# Altium schematic sheet Extra.SchDoc
size A4; SheetNumber: 5; SheetTotal: 5
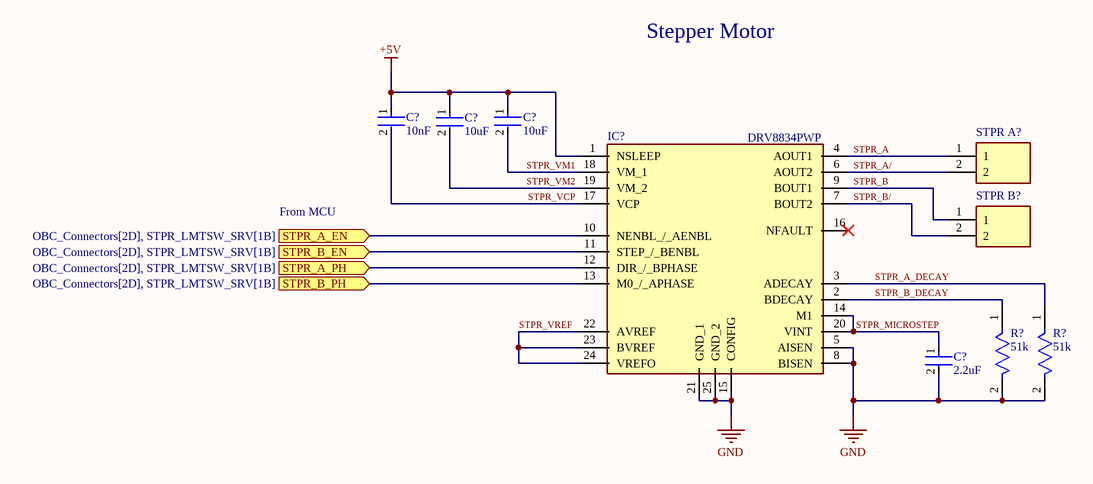
[diagram p0: Extra.SchDoc]

## Parts
(Parts that share a designator on the sheet are numbered #1, #2 ... from top to bottom, then left to right.)
C?#1  10nF  [FP-C1206C-EB-MFG]
C?#2  10uF  [FP-GRM31C-0_2-e0_3_0_8-MFG]
C?#3  10uF  [FP-GRM31C-0_2-e0_3_0_8-MFG]
C?#4  2.2uF  [FP-GRM188-0_1-e0_2_0_5-MFG]
IC?  DRV8834PWP  [SOP65P640X120-25N]
R?#1  51k  [FP-CRCW0603-e3-MFG]
R?#2  51k  [FP-CRCW0603-e3-MFG]
STPR_A?  0022284023  [HDRV2W87P0X254_1X2_508X249X863P]  (value not drawn)
STPR_B?  0022284023  [HDRV2W87P0X254_1X2_508X249X863P]  (value not drawn)

## Ports
STPR_A_EN (in, see OBC_Connectors[2D], STPR_LMTSW_SRV[1B]), STPR_A_PH (in, see OBC_Connectors[2D], STPR_LMTSW_SRV[1B]), STPR_B_EN (in, see OBC_Connectors[2D], STPR_LMTSW_SRV[1B]), STPR_B_PH (in, see OBC_Connectors[2D], STPR_LMTSW_SRV[1B])

## Nets
+5V: C?#1.1 C?#2.1 C?#3.1 IC?.1(NSLEEP)
GND: C?#4.2 IC?.5(AISEN) IC?.8(BISEN) IC?.15(CONFIG) IC?.21(GND_1) IC?.25(GND_2) R?#1.2 R?#2.2
STPR_A: IC?.4(AOUT1) STPR_A?.1
STPR_A/: IC?.6(AOUT2) STPR_A?.2
STPR_A_DECAY: IC?.3(ADECAY) R?#2.1
STPR_A_EN: IC?.10(NENBL_/_AENBL) ; port STPR_A_EN
STPR_A_PH: IC?.12(DIR_/_BPHASE) ; port STPR_A_PH
STPR_B: IC?.9(BOUT1) STPR_B?.1
STPR_B/: IC?.7(BOUT2) STPR_B?.2
STPR_B_DECAY: IC?.2(BDECAY) R?#1.1
STPR_B_EN: IC?.11(STEP_/_BENBL) ; port STPR_B_EN
STPR_B_PH: IC?.13(M0_/_APHASE) ; port STPR_B_PH
STPR_MICROSTEP: C?#4.1 IC?.14(M1) IC?.20(VINT)
STPR_VCP: C?#1.2 IC?.17(VCP)
STPR_VM1: C?#3.2 IC?.18(VM_1)
STPR_VM2: C?#2.2 IC?.19(VM_2)
STPR_VREF: IC?.22(AVREF) IC?.23(BVREF) IC?.24(VREFO)

Not connected (* = marked no-connect by the designer): IC? 16(NFAULT)*

## Notes on the sheet
- Stepper Motor
- From MCU

## Library data of the parts
C?#1 = CMP-03020-011360-1: CAP CER 10000PF 25V 5% NP0 1206; Manufacturer Part Number: C1206C103J3GACTU; Manufacturer: KEMET; Temperature Characteristic: C0G; Value: 10,000 pF; Tolerance: 0.05; Temperature Coefficient: 15%; Material: Ceramic; Automotive Grade: Grade 0; ComponentLink2Description: Datasheet; Digikey Description: CAP CER 10000PF 25V 5% NP0 1206; Device Class L3: Ceramic Capacitors; Mouser Description: 1206 C 10nF Ceramic Multilayer Capacitor; 25 VDC; +125degC; C0G Dielec; +/-5%; Package: C1206C-EB; ComponentLink2URL: https://content.kemet.com/datasheets/KEM_C1007_X8R_ULTRA_150C_SMD.pdf; Temperature: -55°C to +150°C; Octopart: https://octopart.com/c1206c103j3gactu-kemet-126821; Category: Cap; Lead Free: Yes; Device Class L1: Passive Components; Voltage Rating: 25 V; Temperature Range Low: -55°C; Height: 0.88mm; Ipc Land Pattern Name: CAPC320160X78; Temperature Range High: +150°C; Automotive: Yes; Capacitance: 10,000 pF; RoHS: TRUE; Device Class L2: Capacitors
C?#2 C?#3 = CMP-06035-003589-1: Chip Multilayer Ceramic Capacitors for General Purpose, 1206, 10uF, X7R, 15%, 10%, 25V; Case Code (Imperial): 1206; Voltage Rating (DC): 25V; Voltage Rating: 25V; Length: 3.2mm; Lead Free: Lead Free; Thickness: 0.071inch; Package Quantity: 1; Width: 1.6mm; Max Operating Temperature: 125°C; Number of Pins: 2; Height: 1.6mm; Case Code (Metric): 3216; REACH SVHC: No SVHC; Radiation Hardening: No; Case/Package: 1206; Material: Ceramic; Tolerance: 10%; Voltage: 25V; Mount: Surface Mount; Packaging: Tape and Reel; Dielectric: X7R; Termination: SMD/SMT; Min Operating Temperature: -55°C; Capacitance: 10uF; Depth: 1.6mm
C?#4 = CMP-2006-02836-2: Chip Multilayer Ceramic Capacitors for General Purpose, 0603, 2.2uF, X7R, 15%, 10%, 10V; Case Code (Metric): 1608; Height: 0.8mm; Packaging: Cut Tape; Voltage: 10V; Lead Free: Lead Free; Min Operating Temperature: -55°C; Voltage Rating (DC): 10V; Max Operating Temperature: 125°C; Voltage Rating: 10V; Dielectric: X7R; Depth: 0.8mm; Case Code (Imperial): 0603; Termination: SMD/SMT; Case/Package: 0603; Number of Pins: 2; REACH SVHC: No SVHC; Mount: Surface Mount; Width: 0.031inch; Material: Ceramic; Capacitance: 2.2uF; Package Quantity: 1; Weight: 7.1E-05oz; Length: 1.6mm; Thickness: 0.035inch; Tolerance: 10%
IC? = DRV8834PWP: Integrated Circuit; Manufacturer_Name: Texas Instruments; Datasheet Link: https://datasheet.datasheetarchive.com/originals/distributors/Datasheets-SFU2/DSASFU100034685.pdf; Height: 1.2mm; Manufacturer_Part_Number: DRV8834PWP; Mouser Part Number: 595-DRV8834PWP; Mouser Price/Stock: https://www.mouser.co.uk/ProductDetail/Texas-Instruments/DRV8834PWP?qs=UFc95S4Z4CYyQXC6moZRHA%3D%3D; Arrow Part Number: DRV8834PWP; Arrow Price/Stock: https://www.arrow.com/en/products/drv8834pwp/texas-instruments?region=nac
R?#1 R?#2 = CMP-1012-00703-3: RES Thick Film, 51kΩ, 1%, 0.1W, 100ppm/°C, 0603; Resistance: 51kR; Max Power Dissipation: 100mW; Voltage Rating (DC): 75V; Lead Free: Lead Free; Case/Package: 0603; Radiation Hardening: No; Number of Pins: 2; Height: 0.45mm; Depth: 0.85mm; Min Operating Temperature: -55°C; Termination: SMD/SMT; Packaging: Tape and Reel; Military Standard: Not; Case Code (Metric): 1608; Number of Terminations: 2; Power Rating: 100mW; Max Operating Temperature: 155°C; Voltage Rating: 75V; Features: Automotive AEC-Q200; Contact Plating: Tin; Composition: Thick Film; Weight: 7.1E-05oz; Tolerance: 1%; Length: 1.55mm; Package Quantity: 10; Temperature Coefficient: 100ppm/°C; Case Code (Imperial): 0603; Width: 0.85mm
STPR_A? STPR_B? = 0022284023: Connector; Manufacturer_Name: Molex; Datasheet Link: https://www.molex.com/pdm_docs/sd/022284023_sd.pdf; Height: 8.63mm; Manufacturer_Part_Number: 0022284023; Mouser Part Number: N/A; Mouser Price/Stock: https://www.mouser.co.uk/ProductDetail/Molex/0022284023?qs=PBcRNPEHKsr%2FPE%2F%252B8ije0g%3D%3D; Arrow Part Number: 0022284023; Arrow Price/Stock: https://www.arrow.com/en/products/0022284023/molex